# EAGLE design ArduinoRgbController (EAGLE 6.6.0)
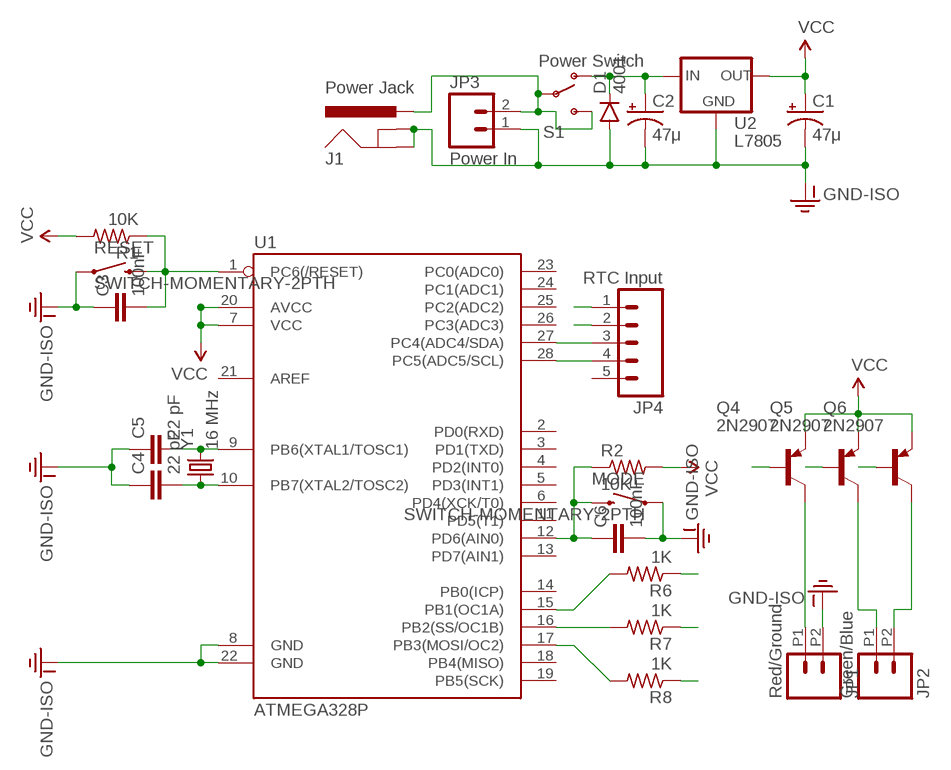
[diagram p0: schematic, sheet 1]

## Parts
C1  47μ  ELECTROLYTIC_CAP2.54MM  [ELECTROLYTIC_CAP]
C2  47μ  ELECTROLYTIC_CAP2.54MM  [ELECTROLYTIC_CAP]
C3  100nF  CAPPTH  [CAP-PTH-SMALL]
C4  22 pF  CAPPTH  [CAP-PTH-SMALL]
C5  22 pF  CAPPTH  [CAP-PTH-SMALL]
C6  100nF  CAPPTH  [CAP-PTH-SMALL]
D1  4001  DIODEPTH  [DIODE-1N4001]
J1  Power Jack  POWER_JACK"  [POWER_JACK]
JP1  Red/Ground  M022.54MM_SCREWTERM  [1X02_2.54_SCREWTERM]
JP2  Green/Blue  M022.54MM_SCREWTERM  [1X02_2.54_SCREWTERM]
JP3  Power In  M025MM  [SCREWTERMINAL-5MM-2]
JP4  RTC Input  M05PTH_LONGPADS  [1X05_LONGPADS]
MODE  SWITCH-MOMENTARY-2PTH  [TACTILE-PTH]
Q4  2N2907  [TO92-EBC-OVAL]
Q5  2N2907  [TO92-EBC-OVAL]
Q6  2N2907  [TO92-EBC-OVAL]
R1  10K  R-US_0207/9  [0207/9]
R2  10K  R-US_0207/9  [0207/9]
R6  1K  R-US_0207/9  [0207/9]
R7  1K  R-US_0207/9  [0207/9]
R8  1K  R-US_0207/9  [0207/9]
RESET  SWITCH-MOMENTARY-2PTH  [TACTILE-PTH]
S1  Power Switch  SWITCH-SPDTPTH  [SWITCH-SPDT]
U1  ATMEGA328P  ATMEGA328P_PDIP  [DIL28-3]
U2  L7805  V_REG_78XXSIDE  [78XXL]
Y1  16 MHz  CRYSTALHC49US  [HC49US]

## Nets
BLUE: Q6.B R8.1
BLUE_LINE: R8.2 U1.17(PB3(MOSI/OC2))
BLUE_OUT: JP2.P2 Q6.C
GND-ISO: C1.- C2.- C3.1 C4.1 C5.1 C6.2 D1.A J1.GND J1.GNDBREAK JP1.P2 JP3.1 JP4.1 MODE.1 RESET.1 U1.8(GND) U1.22(GND) U2.GND
GREEN: Q5.B R7.1
GREEN_LINE: R7.2 U1.16(PB2(SS/OC1B))
GREEN_OUT: JP2.P1 Q5.C
N$1: C5.2 U1.9(PB6(XTAL1/TOSC1)) Y1.2
N$3: C4.2 U1.10(PB7(XTAL2/TOSC2)) Y1.1
PC4: JP4.3 U1.27(PC4(ADC4/SDA))
PC5: JP4.4 U1.28(PC5(ADC5/SCL))
RED: Q4.B R6.1
RED_LINE: R6.2 U1.15(PB1(OC1A))
RED_OUT: JP1.P1 Q4.C
RESET_LINE: C3.2 R1.1 RESET.3 U1.1(PC6(/RESET))
SWITCH_LINE: C6.1 MODE.3 R2.1 U1.12(PD6(AIN0))
VCC: C1.+ JP4.2 Q4.E Q5.E Q6.E R1.2 R2.2 U1.7(VCC) U1.20(AVCC) U2.OUT
VIN_POSTSWITCH: C2.+ D1.C S1.1(O) U2.IN
VIN_PRESWITCH: J1.PWR JP3.2 S1.2(P) S1.3(S)
Unconnected: JP4.5 U1.2(PD0(RXD)) U1.3(PD1(TXD)) U1.4(PD2(INT0)) U1.5(PD3(INT1)) U1.6(PD4(XCK/T0)) U1.11(PD5(T1)) U1.13(PD7(AIN1)) U1.14(PB0(ICP)) U1.18(PB4(MISO)) U1.19(PB5(SCK)) U1.21(AREF) U1.23(PC0(ADC0)) U1.24(PC1(ADC1)) U1.25(PC2(ADC2)) U1.26(PC3(ADC3))

## Library data of the parts
C1 C2 = RBBB:ELECTROLYTIC_CAP: POLARIZED CAPACITOR, American symbol
C3-C6 = SparkFun-Capacitors:CAP: Capacitor Standard 0603 ceramic capacitor, and 0.1" leaded capacitor.
D1 = SparkFun-DiscreteSemi:DIODE: Diode These are standard reverse protection diodes and small signal diodes. SMA package can handle up to about 1A. SOD-323 can handle about 200mA. What the SOD-323 package when ordering, there are some mfgs out there that are 5-pin packages.
J1 = RBBB:POWER_JACK: Power Jack This is the standard 5.5mm barrel jack for power. The PTH is the most common, proven, reliable, footprint. All others are experimental. The Slot footprint only works if the mill layer is transmitted to the PCB fab house so be warned. Spark Fun Electronics SKU : PRT-00119. Mating wall wart : TOL-00298 (and others)
JP1 JP2 = SparkFun-Connectors:M02: Standard 2-pin 0.1" header. Use with - straight break away headers ( PRT-00116) - right angle break away headers (PRT-00553) - swiss pins (PRT-00743) - machine pins (PRT-00117) - female headers (PRT-00115) Molex polarized connector foot print use with: PRT-08233 with associated crimp pins and housings. 2.54_SCREWTERM for use with PRT-10571. 3.5mm Screw Terminal footprints for PRT-08084 5mm Screw Terminal footprints for use with PRT-08432
JP3 = SparkFun-Connectors:M02: Standard 2-pin 0.1" header. Use with - straight break away headers ( PRT-00116) - right angle break away headers (PRT-00553) - swiss pins (PRT-00743) - machine pins (PRT-00117) - female headers (PRT-00115) Molex polarized connector foot print use with: PRT-08233 with associated crimp pins and housings. 2.54_SCREWTERM for use with PRT-10571. 3.5mm Screw Terminal footprints for PRT-08084 5mm Screw Terminal footprints for use with PRT-08432; STOREFRONT_ID: PRT-08432
JP4 = SparkFun-Connectors:M05: Header 5 Standard 5-pin 0.1" header. Use with straight break away headers (SKU : PRT-00116), right angle break away headers (PRT-00553), swiss pins (PRT-00743), machine pins (PRT-00117), and female headers (PRT-00115). Molex polarized connector foot print use with SKU : PRT-08230 with associated crimp pins and housings.
MODE RESET = SparkFun-Electromechanical:SWITCH-MOMENTARY-2: Various NO switches- pushbuttons, reed, etc; PROD_ID: SWCH-08441
Q4-Q6 = adafruit:2N2907*: PNP Transistor Big Oval pads
R1 R2 R6-R8 = adafruit:R-US_: RESISTOR, American symbol
S1 = SparkFun-Electromechanical:SWITCH-SPDT: SPDT Switch Simple slide switch, Spark Fun Electronics SKU : COM-00102 DPDT SMT slide switch, AYZ0202, SWCH-08179; PROD_ID: SWCH-08261
U1 = SparkFun-DigitalIC:ATMEGA328P_PDIP: uC used in the Arduino 32kb flash, 1k EEPROM, 2k SRAM This is the through-hole version of this chip.
U2 = SparkFun-PowerIC_01:V_REG_78XX: Voltage Regulator Standard 78xx regulator. IGO (Input Ground Output). Spark Fun Electronics SKU : COM-00107
Y1 = SparkFun-FreqCtrl:CRYSTAL: Various standard crystals. Proven footprints.

## Board
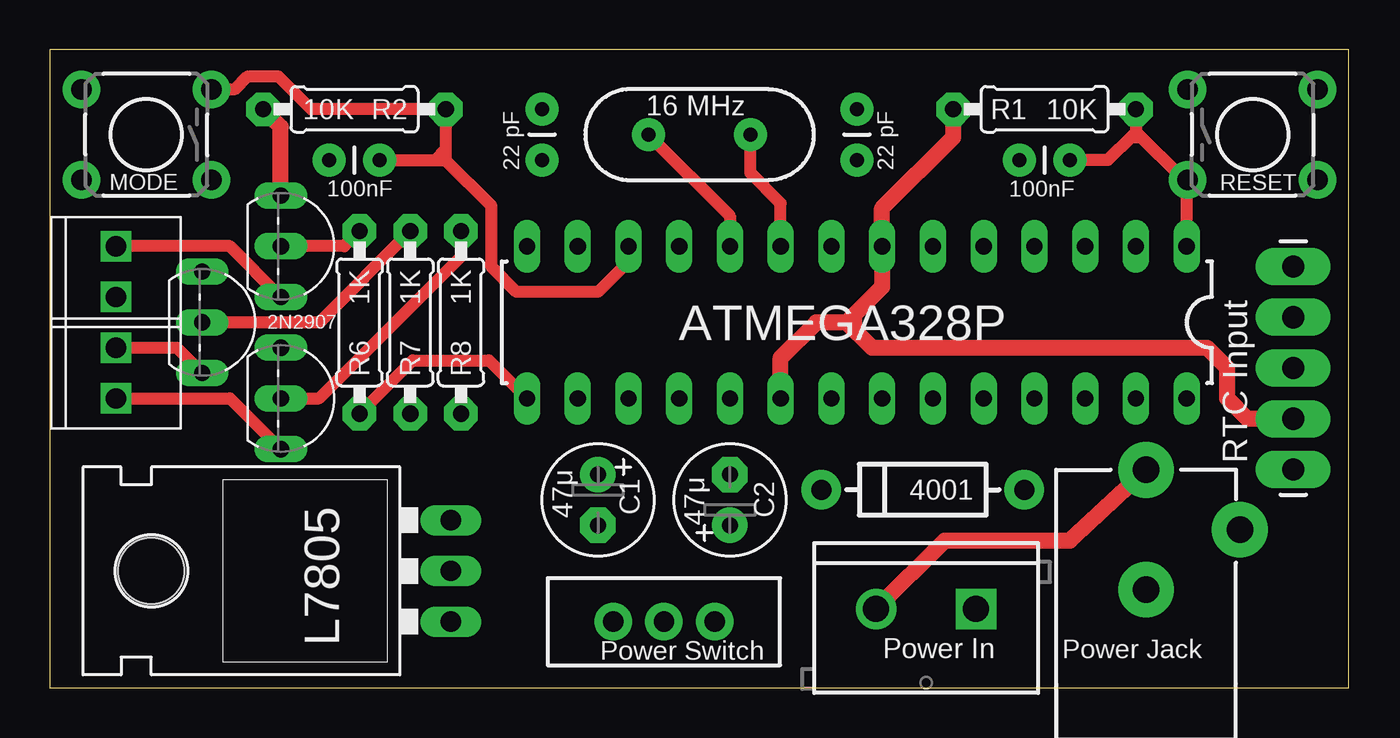
[diagram p1: board, top side]
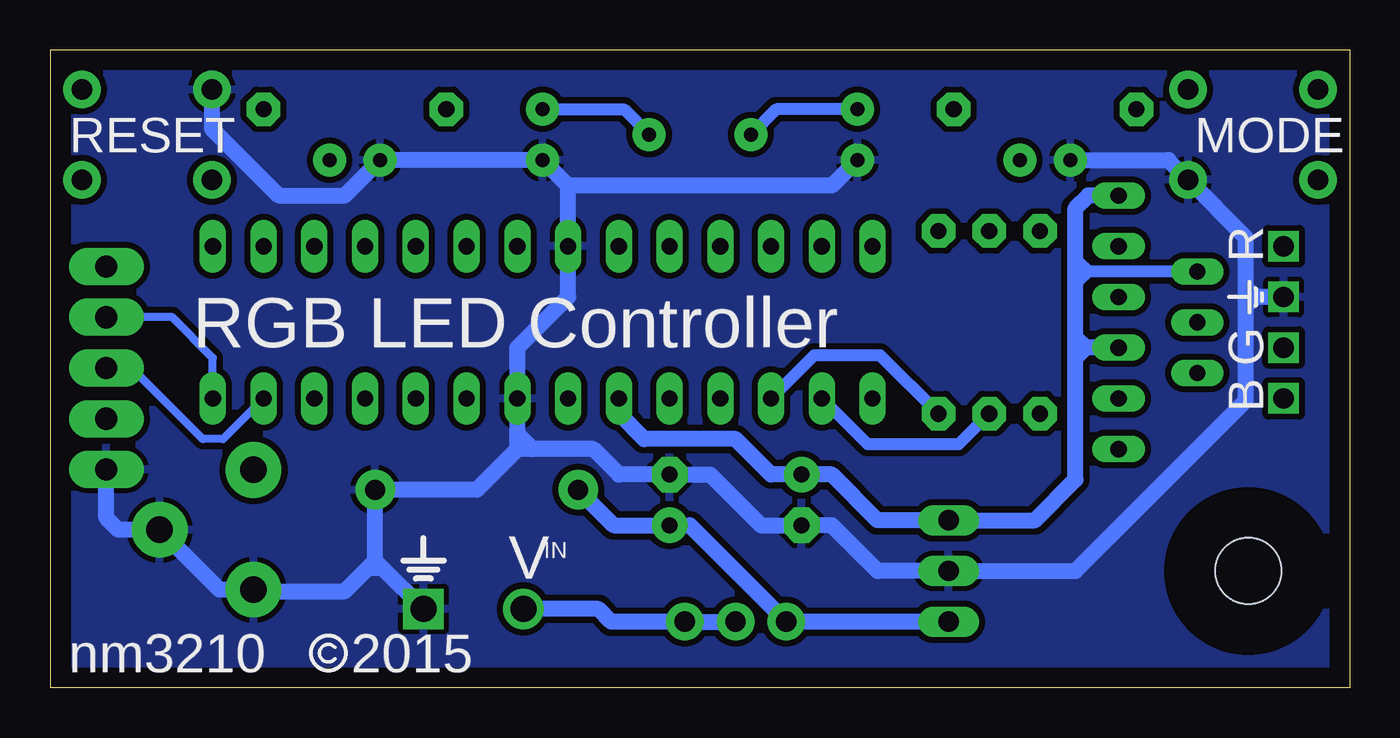
[diagram p2: board, bottom side, seen from below]

Size 65 x 31.93 mm. Coordinates in mm from the lower left corner, seen from the top.
Outline: 0,0 65,0 65,31.93 0,31.93 0,0
Copper layers (1*16): Top 0.035mm / dielectric 1.5mm / Bottom 0.035mm
Design rules "default *": minimum track width 10mil, minimum drill 24mil, track to track 12mil, track to pad 12mil, pad to pad 12mil, via to via 12mil, smd to smd 8mil, copper to edge 40mil, drill to drill 8mil, minimum pad ring 10mil, minimum via ring 8mil, stop-mask expansion 4mil, vias tented up to drill 0mil, thermal gap 10mil

### Footprints (pad centres in the part's own frame; a part is rotated, then mirrored left to right if it is on the bottom)
ELECTROLYTIC_CAP = drill 0.813 pad 1.778: + -1.27,0 | drill 0.813 pad 1.778 octagon: - 1.27,0
CAP-PTH-SMALL = drill 0.7 pad 1.651: 1 0,0; 2 2.54,0
DIODE-1N4001 = drill 1 pad 1.981: A -5.08,0; C 5.08,0
POWER_JACK = drill 1.321 pad 2.794: GND 0,7.7; GNDBREAK 4.7,10.7; PWR 0,13.7
1X02_2.54_SCREWTERM = drill 1.016 square: P1 2.54,0; P2 0,0
SCREWTERMINAL-5MM-2 = drill 1.3 pad 2.032 square: 1 0,0 | drill 1.3 pad 2.032: 2 5,0
1X05_LONGPADS = drill 1.118 pad 1.88 long: 1 0,0; 2 2.54,0; 3 5.08,0; 4 7.62,0; 5 10.16,0
TACTILE-PTH = drill 1.016 pad 1.88: 1 -3.251,2.261; 2 3.251,2.261; 3 -3.251,-2.261; 4 3.251,-2.261
TO92-EBC-OVAL = drill 0.813 long: B 0,-1.27; C 2.54,-1.27; E -2.54,-1.27
0207/9 = drill 0.813 pad 1.676 octagon: 1 -4.572,0; 2 4.572,0
SWITCH-SPDT = drill 1.016 pad 1.88: 1 0,2.54; 2 0,0; 3 0,-2.54
DIL28-3 = drill 0.813 long: 1 -16.51,-3.81; 2 -13.97,-3.81; 3 -11.43,-3.81; 4 -8.89,-3.81; 5 -6.35,-3.81; 6 -3.81,-3.81; 7 -1.27,-3.81; 8 1.27,-3.81; 9 3.81,-3.81; 10 6.35,-3.81; 11 8.89,-3.81; 12 11.43,-3.81; 13 13.97,-3.81; 14 16.51,-3.81; 15 16.51,3.81; 16 13.97,3.81; 17 11.43,3.81; 18 8.89,3.81; 19 6.35,3.81; 20 3.81,3.81; 21 1.27,3.81; 22 -1.27,3.81; 23 -3.81,3.81; 24 -6.35,3.81; 25 -8.89,3.81; 26 -11.43,3.81; 27 -13.97,3.81; 28 -16.51,3.81
78XXL = drill 1.016 long: GND 0,-3.81; IN -2.54,-3.81; OUT 2.54,-3.81 | hole 3.302: 0,11.176
HC49US = drill 0.7 pad 1.651: 1 -2.54,0; 2 2.54,0

### Placement (x,y rotation side)
C1  27.43,9.4 270 top
C2  34.04,9.4 90 top
C3  48.51,26.42 0 top
C4  24.64,26.42 90 top
C5  40.39,26.42 90 top
C6  16.51,26.42 180 top
D1  43.69,9.91 180 top
J1  54.86,-2.79 0 top
JP1  3.3,19.56 90 top
JP2  3.3,14.48 90 top
JP3  46.36,3.94 180 top
JP4  62.23,10.92 90 top
MODE  4.83,27.69 180 top
Q4  12.83,22.1 270 top
Q5  8.89,18.29 270 top
Q6  12.83,14.48 270 top
R1  49.78,28.96 180 top
R2  15.24,28.96 180 top
R6  15.49,18.29 270 top
R7  18.03,18.29 270 top
R8  20.57,18.29 270 top
RESET  60.2,27.69 0 top
S1  30.73,3.3 90 top
U1  40.39,18.29 180 top
U2  16.26,5.84 90 top
Y1  32.51,27.69 0 top

### Tracks (layer width: path | path; a pad name or v marks a point on that pad's centre or on a via)
BLUE
  Top 0.61: Q6.B 13.46,14.48 20.57,21.59 R8.1
BLUE_LINE
  Bottom 0.61: U1.17 26.8,16.64 23.49,16.64 R8.2
BLUE_OUT
  Top 0.61: Q6.C 9.02,14.48 JP2.P2
GND-ISO
  Bottom 0.813: 41.66,11.94 41.66,12.7 | 41.66,12.7 U1.22 41.66,17.02 39.12,19.56 U1.8 39.12,25.15 | 39.12,25.15 C5.1 C3.1 50.29,24.64 53.59,24.64 56.95,27.99 RESET.1 | 41.66,11.94 43.69,9.91 48.01,9.91 | 48.01,9.91 D1.A 48.77,9.14 | 40.89,11.94 37.85,11.94 36.58,10.67 C2.- 32,10.67 29.46,8.13 C1.- 25.91,8.13 23.62,5.84 U2.GND 13.72,5.84 5.21,14.35 5.21,19.05 | 40.89,11.94 41.66,11.94 | 41.66,12.7 40.89,11.94 | 5.21,20.07 5.21,22.55 MODE.1 | 5.21,20.07 5.21,19.81 | 5.21,19.81 5.21,19.05 | MODE.1 8.05,25.4 | 4.7,19.56 5.21,19.81 | 5.21,20.07 4.7,19.56 | 4.7,19.56 5.21,19.05 | MODE.1 9.07,26.42 C6.2 | C4.1 25.91,25.15 39.12,25.15 | 48.77,6.35 48.77,9.14 | 48.01,9.91 48.77,9.14 | JP3.1 48.39,5.97 | 48.39,5.97 48.77,6.35 | 49.15,5.97 50.29,4.83 54.78,4.83 J1.GND 56.56,4.91 J1.GNDBREAK 61.63,7.91 62.23,8.51 JP4.1 | 49.15,5.97 48.77,6.35 | 48.39,5.97 49.15,5.97 | JP1.P2 4.7,19.56
  pour Bottom: 0,0 65.02,0 65.02,32 0,32
GREEN
  Top 0.61: R7.1 13.46,18.29 Q5.B
GREEN_LINE
  Bottom 0.61: U1.16 24.13,12.19 19.56,12.19 R7.2
GREEN_OUT
  Top 0.61: Q5.C 6.35,17.02 JP2.P1
N$1
  Top 0.61: U1.9 36.58,24.26 35.05,25.78 Y1.2
  Bottom 0.61: C5.2 36.32,28.96 Y1.2
N$3
  Top 0.61: Y1.1 34.04,23.62 U1.10
  Bottom 0.61: C4.2 28.7,28.96 Y1.1
PC4
  Bottom 0.406: U1.27 56.39,12.45 57.4,12.45 60.96,16 JP4.3
PC5
  Bottom 0.406: U1.28 56.9,16.51 58.93,18.54 JP4.4
RED
  Top 0.61: R6.1 14.73,22.1 Q4.B
RED_LINE
  Top 0.61: R6.2 18.16,16.38 21.97,16.38 U1.15
RED_OUT
  Top 0.61: Q4.C 9.02,22.1 JP1.P1
RESET_LINE
  Top 0.61: U1.1 56.9,25.38 RESET.3 56.74,25.42 54.36,27.81 | R1.1 54.36,27.81 | 54.36,27.81 54.16,27.62 | 54.16,27.62 52.96,26.42 C3.2 | 54.48,27.56 54.23,27.56 54.16,27.62
SWITCH_LINE
  Top 0.61: U1.12 28.96,21.34 27.43,19.81 23.37,19.81 22.1,21.08 22.1,24.13 19.81,26.42 19.68,26.42 | C6.1 19.3,26.42 | 19.3,26.42 19.68,26.42 | MODE.3 8.1,29.97 9.27,29.97 9.91,30.61 11.43,30.61 13.08,28.96 R2.1 19.81,26.92 | 19.81,26.92 19.81,26.54 19.68,26.42 | 19.3,26.42 19.81,26.92
VCC
  Top 0.813: JP4.2 59.94,13.46 58.93,14.48 58.93,16 57.91,17.02 41.15,17.02 39.88,18.29 | R1.2 45.21,27.56 41.66,24 U1.7 41.66,20.07 39.88,18.29 | U1.20 36.58,16.51 38.35,18.29 39.88,18.29 | 40.26,18.03 40.26,18.29 | 40.26,18.29 40.26,18.54 | 39.88,18.29 40.26,18.29 | Q4.E 11.56,28.07 R2.2
  Bottom 0.61: Q5.E 13.08,20.83 | 13.08,20.83 13.72,20.83 | 13.08,20.83 13.59,21.34 | 13.08,20.83 13.59,20.32
  Bottom 0.813: U1.20 36.58,13.72 35.31,12.45 30.73,12.45 28.96,10.67 C1.+ 25.91,10.67 23.62,8.38 U2.OUT 15.75,8.38 13.72,10.41 13.72,16.51 | 13.72,16.51 13.72,17.02 | 13.72,17.02 13.72,17.53 | 13.72,17.53 13.72,20.83 13.72,24 13.08,24.64 Q4.E | Q6.E 13.21,17.02 | 13.21,17.02 13.72,17.02 | 13.21,17.02 13.72,17.53 | 13.72,16.51 13.34,16.89
VIN_POSTSWITCH
  Bottom 0.813: D1.C 36.83,8.13 C2.+ 33.02,8.13 S1.1 U2.IN
VIN_PRESWITCH
  Top 0.813: J1.PWR 54.85,10.91 51.05,7.37 44.78,7.37 JP3.2
  Bottom 0.813: JP3.2 37.59,3.94 36.96,3.3 S1.3 S1.2

### Text on the board
bNames: MODE | RESET | R | G | RGB LED Controller | B | IN | V | 2015 | nm3210